# Altium schematic sheet battery_charger.SchDoc
size A; SheetNumber: 3; SheetTotal: 3
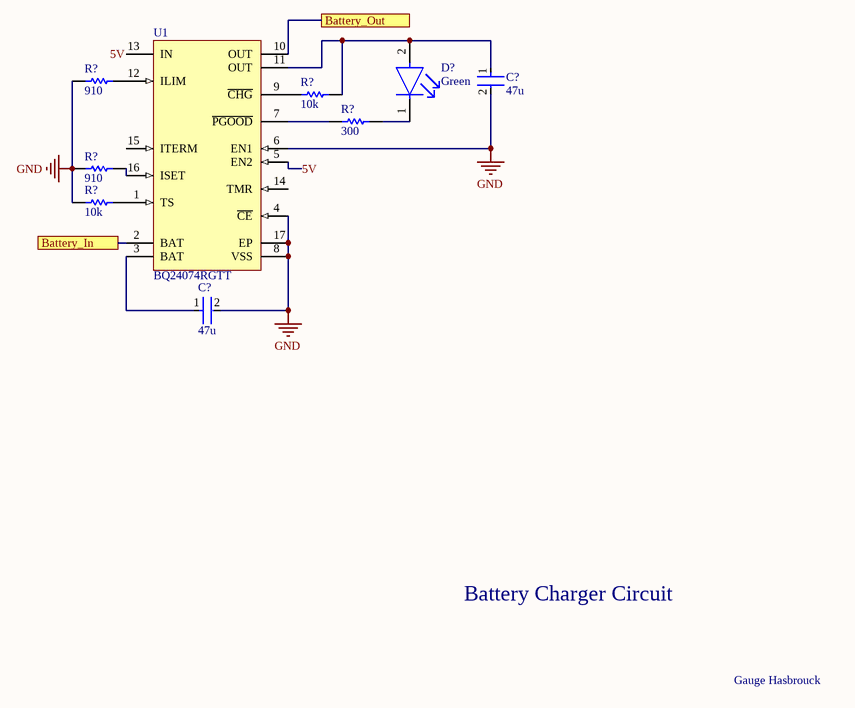
[diagram p0: battery_charger.SchDoc]

## Parts
(Parts that share a designator on the sheet are numbered #1, #2 ... from top to bottom, then left to right.)
C?#1  47u  [FP-GRM21B-0_2-MFG]
C?#2  47u  [FP-GRM21B-0_2-MFG]
D?  Green  [FP-LTST-C170GKT-MFG]
R?#1  910  [RESC1005X40X25LL05T10]
R?#2  10k  [RESC1005X40X25LL05T10]
R?#3  300  [RESC1005X40X25LL05T10]
R?#4  910  [RESC1005X40X25LL05T10]
R?#5  10k  [RESC1005X40X25LL05T10]
U1  BQ24074RGTT  [RGT0016C_V]

## Ports
Battery_In, Battery_Out

## Nets
GND: C?#1.2 C?#2.2 R?#1.1 R?#4.1 R?#5.1 U1.4(~{CE}) U1.6(EN1) U1.8(VSS) U1.17(EP)
5V: U1.5(EN2) U1.13(IN)
Battery_In: U1.2(BAT) ; port Battery_In
Battery_Out: U1.10(OUT) ; port Battery_Out
NetC?#1_1: C?#1.1 D?.2(A) R?#2.2 U1.11(OUT)
NetC?#2_1: C?#2.1 U1.3(BAT)
NetD?_1: D?.1(C) R?#3.2
NetR?#1_2: R?#1.2 U1.12(ILIM)
NetR?#2_1: R?#2.1 U1.9(~{CHG})
NetR?#3_1: R?#3.1 U1.7(~{PGOOD})
NetR?#4_2: R?#4.2 U1.16(ISET)
NetR?#5_2: R?#5.2 U1.1(TS)

Not connected (* = marked no-connect by the designer): U1 14(TMR) 15(ITERM)

## Notes on the sheet
- Battery Charger Circuit
- Gauge Hasbrouck

## Library data of the parts
C?#1 C?#2 = CMP-2007-03221-2: CAP CER 47UF 6.3V X5R 0805; Tolerance: 20%; Min Operating Temperature: -55°C; Depth: 1.25mm; Thickness: 0.057inch; RoHS Compliant: Yes; Dielectric: X5R; Voltage Rating: 6.3V; Case/Package: 0805; Height: 1.25mm; Package Quantity: 3000; Case Code (Metric): 2012; Termination: SMD/SMT; Packaging: Tape and Reel; Voltage Rating (DC): 6.3V; Weight: 0.000335oz; Width: 0.049inch; Capacitance: 47uF; Length: 2mm; Lead Free: Lead Free; Max Operating Temperature: 85°C; Voltage: 6.3V; REACH SVHC: No SVHC; Mount: Surface Mount; Case Code (Imperial): 0805
D? = CMP-1674-00002-6: LED GREEN CLEAR SMD; Dominant Wavelength: 569nm; Lens Style: Diffused; Forward Voltage: 2.1V; Number of Elements: 1; Wavelength: 565nm; Luminous Intensity: 6mcd; Test Current: 10mA; Power Dissipation: 100mW; Reverse Voltage: 5V; Forward Current: 30mA; Viewing Angle: 130°; Lens Color: Colorless; Min Operating Temperature: -55°C; Number of Pins: 2; Max Operating Temperature: 85°C; Color: Green; Radiation Hardening: No; Illumination Color: Green; Case Code (Metric): 2012; Lens Transparency: Clear; Case/Package: 0805; Width: 1.25mm; Case Code (Imperial): 0805; Package Quantity: 1; Height: 1.1mm; Depth: 1.25mm; Length: 2mm; Power Rating: 100mW; Lead Free: Lead Free; Number of LEDs: 1; Packaging: Tape and Reel; Mount: Surface Mount; Voltage: 5V
R?#1 R?#4 = CMP-2002-07033-1: Manufacturer: Yageo / Phycomp; Part Number: RC0402FR-07910RL
R?#2 R?#5 = CMP-2002-07353-1: Part Number: RC0402FR-0710KL; Manufacturer: Yageo / Phycomp
R?#3 = CMP-2002-07009-1: Part Number: RC0402FR-07300RL; Manufacturer: Yageo / Phycomp
U1 = CMP-0321-00218-2: USB-Friendly Li-Ion Battery Charger and Power-Path Management IC, 10.5 V OVP, 4.3 V, -40 to 85 degC, 16-pin QFN (RGT), Green (RoHS & no Sb/Br); Manufacturer: Texas Instruments; Li-Ion: N; Vin(Min)(V): 4.3; SubFamily: Battery Charge Management; ComponentLink1Description: Datasheet; NiMH: N; Mounting Technology: Surface Mount; Lead Acid: N; DatasheetVersion: SLUS810G; PackageReference: RGT0016C; ComponentLink1URL: http://www.ti.com/general/docs/lit/getliterature.tsp?genericPartNumber=BQ24074&fileType=pdf; Li-Polymer: N; Code_JEDEC: MO-220; NiCd: N; PackageVersion: revH, Oct-2011; Eco-Plan: Green (RoHS & no Sb/Br); PackageDescription: 16-Pin Plastic Quad Flat No-Lead, 3 x 3 mm Body, 0.5 mm Pitch, 1.7 x 1.7 mm Exposed Pad; PartNumber: BQ24074RGTT; Over Voltage Protection: N